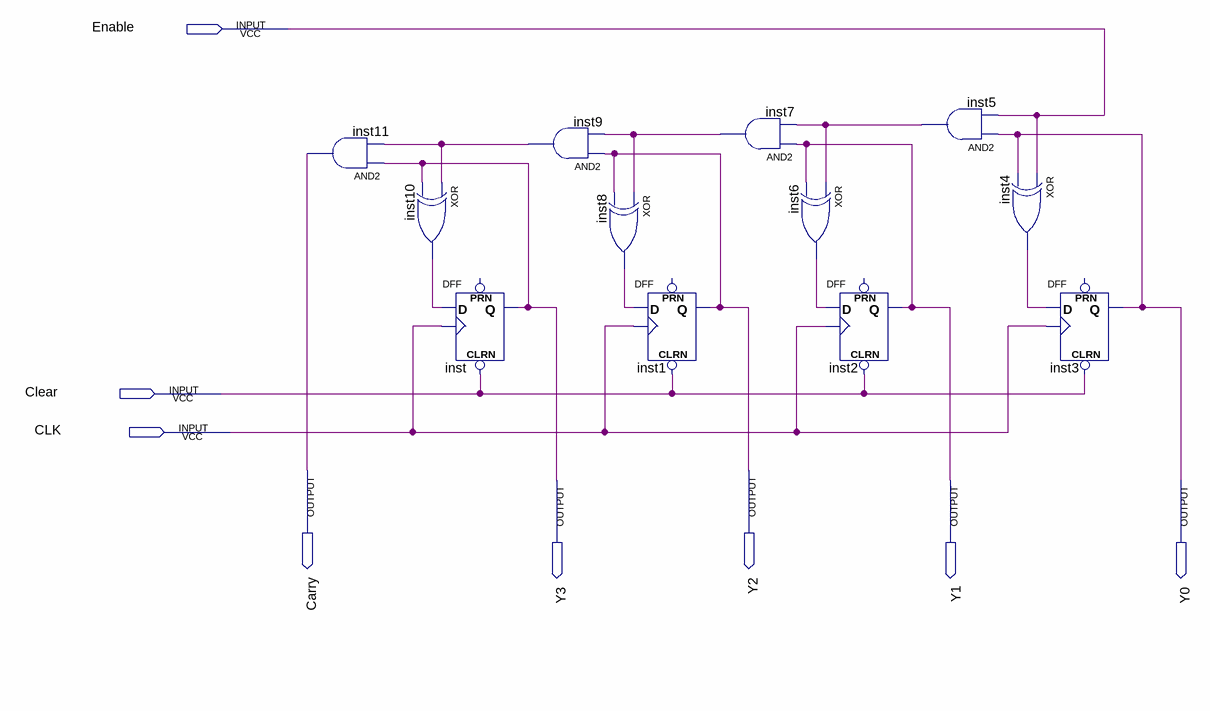
[diagram p0: schematic sheet]
// Quartus schematic Counter_increase.bdf as structural Verilog: 12 symbols, 8 pins
module Counter_increase (
  input  Enable,
  input  Clear,
  input  CLK,
  output Carry,
  output Y2,
  output Y3,
  output Y1,
  output Y0
);

  wire inst4_out, inst5_out, inst6_out, inst7_out, inst8_out, inst9_out, inst10_out;

  and inst11 (Carry, Y3, inst9_out);
  xor inst10 (inst10_out, inst9_out, Y3);
  DFF inst (.CLRN(Clear), .CLK(CLK), .D(inst10_out), .Q(Y3));  // open: PRN
  and inst9 (inst9_out, Y2, inst7_out);
  xor inst8 (inst8_out, inst7_out, Y2);
  DFF inst1 (.CLRN(Clear), .CLK(CLK), .D(inst8_out), .Q(Y2));  // open: PRN
  and inst7 (inst7_out, Y1, inst5_out);
  xor inst6 (inst6_out, inst5_out, Y1);
  DFF inst2 (.CLRN(Clear), .CLK(CLK), .D(inst6_out), .Q(Y1));  // open: PRN
  and inst5 (inst5_out, Y0, Enable);
  xor inst4 (inst4_out, Enable, Y0);
  DFF inst3 (.CLRN(Clear), .CLK(CLK), .D(inst4_out), .Q(Y0));  // open: PRN
endmodule
